# EAGLE design Data_Interlock (EAGLE 7.1.0)
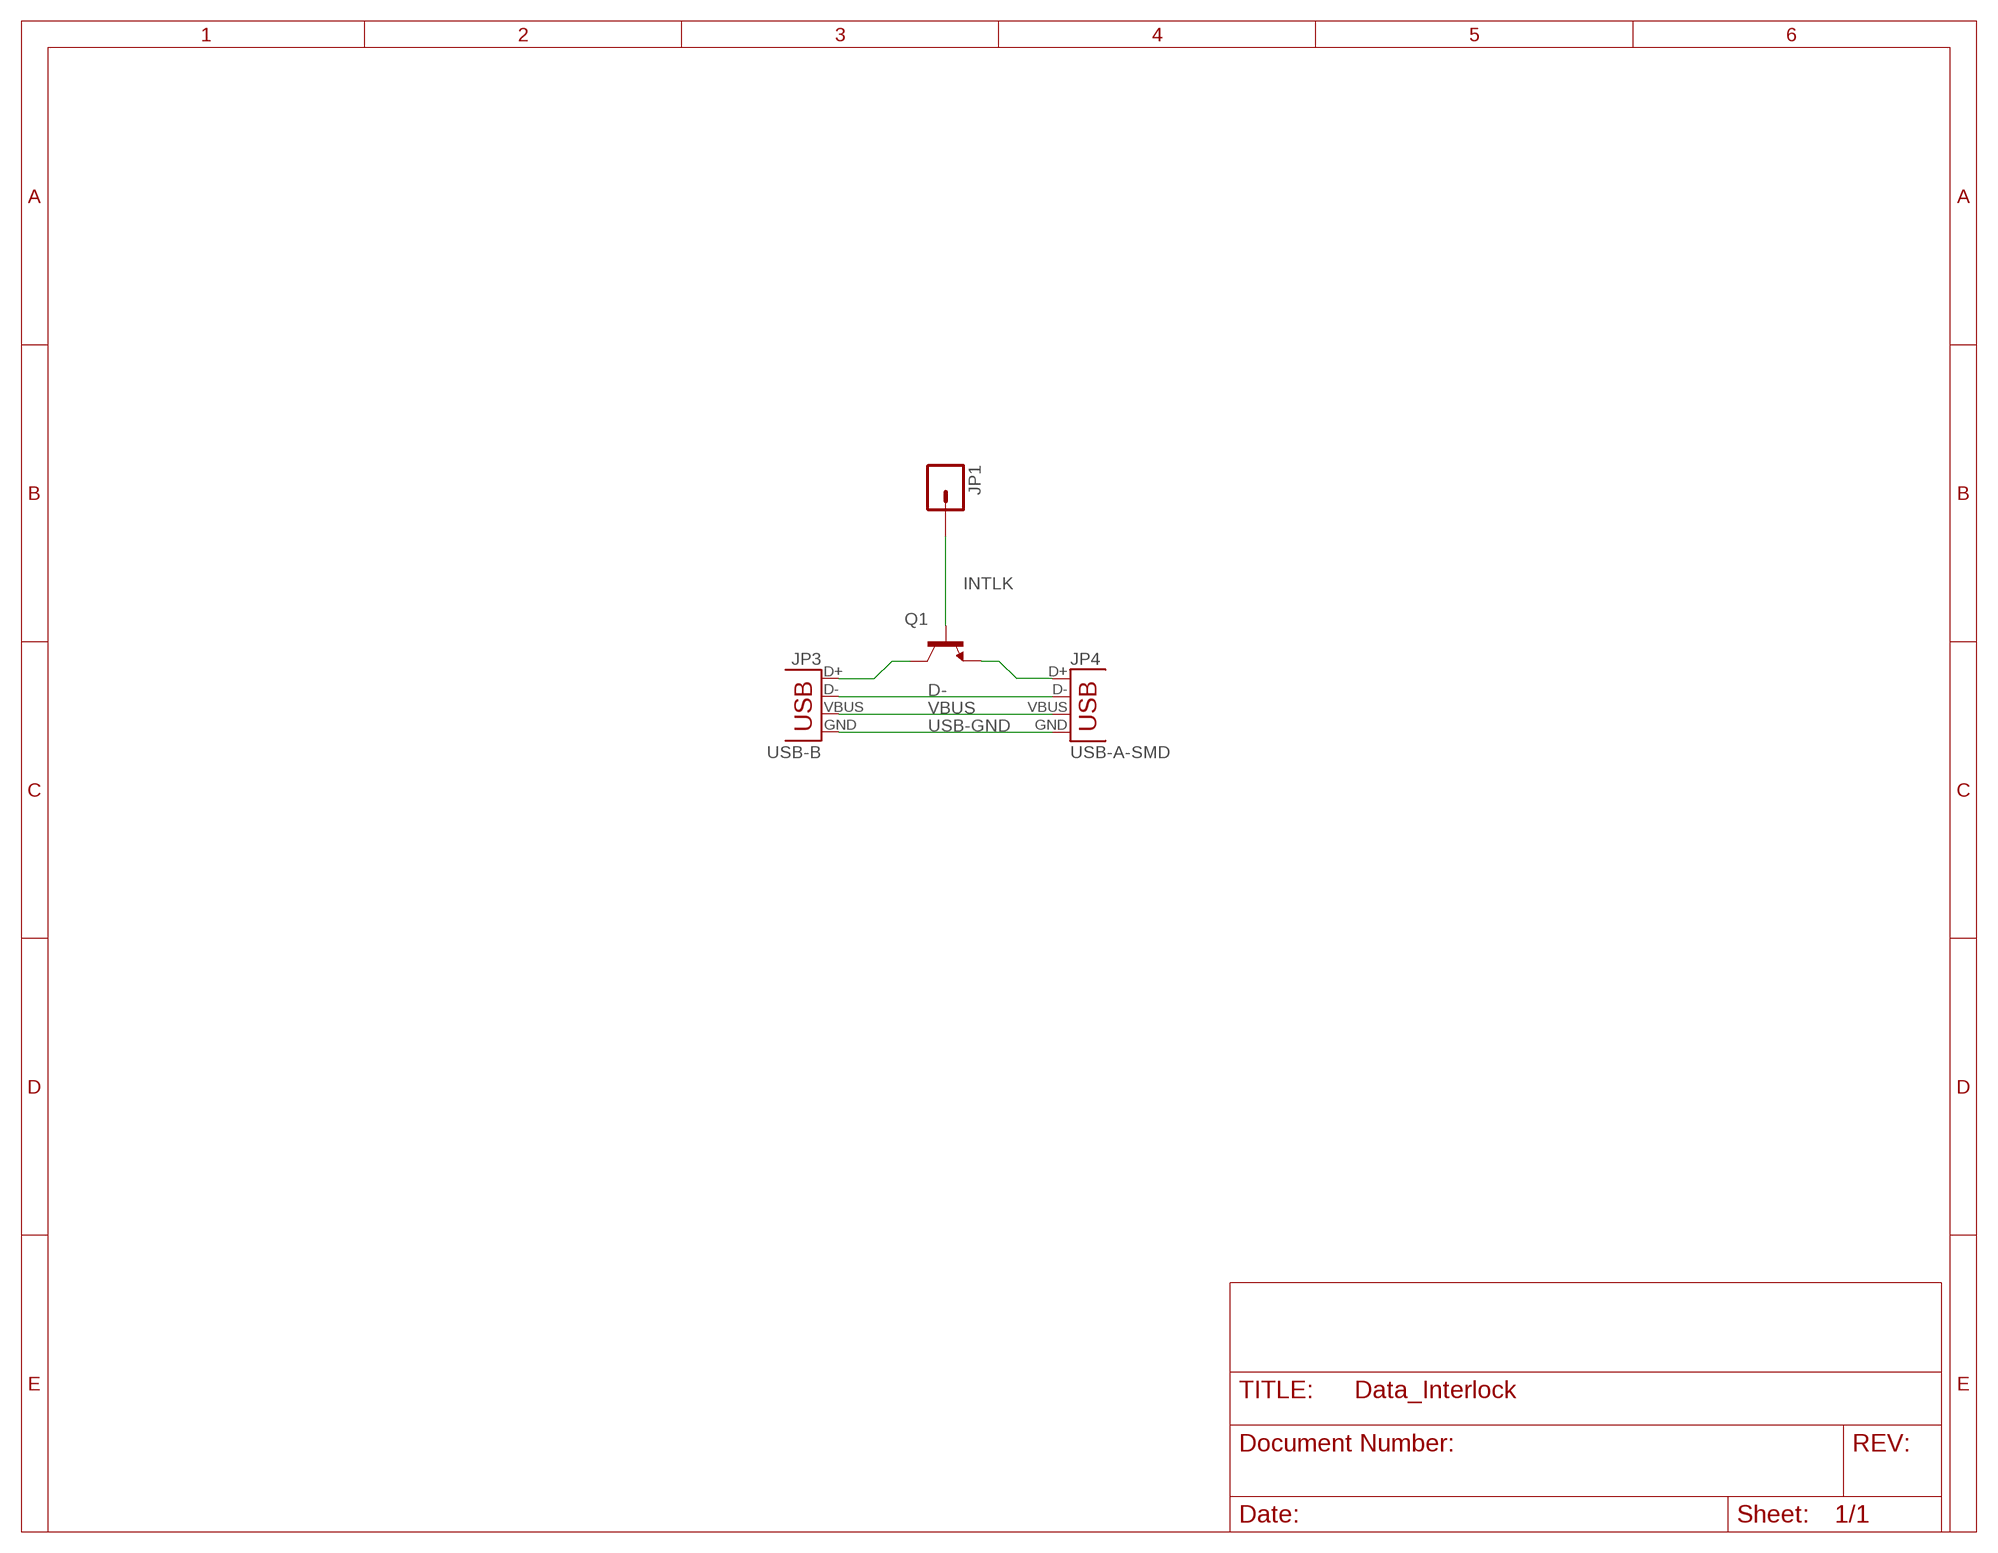
[diagram p0: schematic, sheet 1]

## Parts
JP1  M01PTH_LONGPAD  [1X01_LONGPAD]
JP3  USB-B  USBPTH  [USB-B-PTH]
JP4  USB-A-SMD  [USB-A-S-NOSILK-FEMALE]
Q1  TRANSISTOR_NPNBC547  [TO-92-AMMO]

## Nets
D-: JP3.D- JP4.D-
INTLK: JP1.1 Q1.2(B)
N$4: JP3.D+ Q1.1(C)
N$5: JP4.D+ Q1.3(E)
USB-GND: JP3.GND JP4.GND
VBUS: JP3.VBUS JP4.VBUS

## Library data of the parts
JP1 = SparkFun-Connectors:M01: Header 1 Standard 1-pin 0.1" header. Use with straight break away headers (SKU : PRT-00116), right angle break away headers (PRT-00553), swiss pins (PRT-00743), machine pins (PRT-00117), and female headers (PRT-00115).
JP3 = SparkFun-Connectors:USB: USB Connectors USB-B-PTH is fully proven SKU : PRT-00139/CONN-08278 USB-miniB is fully proven SKU : PRT-00587 USB-A-PCB is untested. USB-A-H is throughly reviewed, but untested. Spark Fun Electronics SKU : PRT-00437 USB-B-SMT is throughly reviewed, but untested. Needs silkscreen touching up. USB-A-S has not been used/tested USB-MB-H has not been used/tested USB-MICROB has been used. CONN-09505; PROD_ID: CONN-08278
JP4 = SparkFun-Connectors:USB: USB Connectors USB-B-PTH is fully proven SKU : PRT-00139/CONN-08278 USB-miniB is fully proven SKU : PRT-00587 USB-A-PCB is untested. USB-A-H is throughly reviewed, but untested. Spark Fun Electronics SKU : PRT-00437 USB-B-SMT is throughly reviewed, but untested. Needs silkscreen touching up. USB-A-S has not been used/tested USB-MB-H has not been used/tested USB-MICROB has been used. CONN-09505; PROD_ID: CONN-09520
Q1 = SparkFun-DiscreteSemi:TRANSISTOR_NPN: Generic NPN BJT MMBT2222A - TRANS-08049 (SOT-23, 1A 40V) MPSA42 - TRANS-09116 (SOT-23, 500mA 300V) MMBT5088LT1G - TRANS-11160 (SOT-23, 50 mA 30V) BC547 - COM-08928 <http://www.sparkfun.com/products/8928> (TO-92 45V 100mA) (1.Collector 2.Base 3.Emitter) 2N3904 - COM-00521 <http://www.sparkfun.com/products/521> (TO-92 40V 200mA) (1.Emitter 2.Base 3.Collector) P2N2222A - COM-12852 <http://www.sparkfun.com/products/12852> (TO-92 40V 600mA) (1.Collector 2.Base 3.Emitter)

## Board
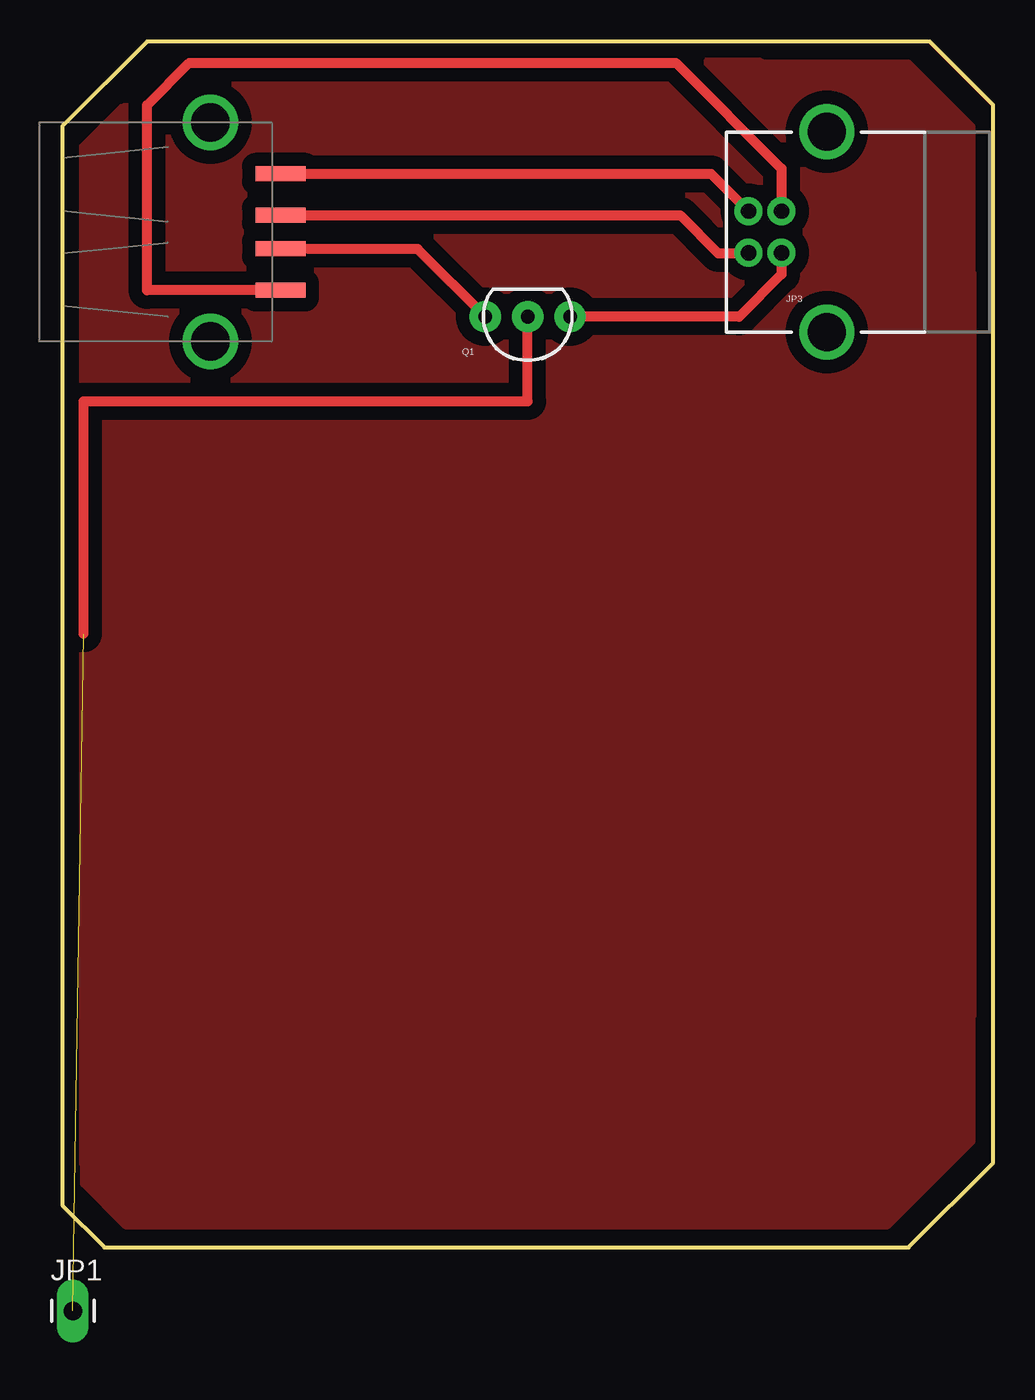
[diagram p1: board, top side]

Size 55.88 x 72.39 mm. Coordinates in mm from the lower left corner, seen from the top.
Outline: 0,2.54 2.54,0 50.8,0 55.88,5.08 55.88,68.58 52.07,72.39 5.08,72.39 0,67.31 0,2.54
Copper layers (1*16): Top 0.035mm / dielectric 1.5mm / Bottom 0.035mm
Design rules "default *": minimum track width 24mil, minimum drill 24mil, track to track 32mil, track to pad 32mil, pad to pad 16mil, via to via 16mil, smd to smd 16mil, copper to edge 24mil, drill to drill 8mil, minimum pad ring 10mil, minimum via ring 8mil, stop-mask expansion 4mil, vias tented up to drill 0mil, thermal gap 18mil

### Footprints (pad centres in the part's own frame; a part is rotated, then mirrored left to right if it is on the bottom)
1X01_LONGPAD = drill 1.118 pad 1.88 long: 1 0,0
USB-B-PTH = drill 0.914 pad 1.676: D+ 0,1.25; D- 1.981,1.25; GND 0,-1.25; VBUS 1.981,-1.25 | drill 2.286: S1 -2.718,-6.02; S2 -2.718,6.02
USB-A-S-NOSILK-FEMALE = smd 3 x 0.9: D+ 4.212,-1; D- 4.212,1; GND 4.212,-3.5; VBUS 4.212,3.5 | drill 2.311: S1 0,-6.566; S2 0,6.566
TO-92-AMMO = drill 0.813 pad 1.88: 1 -2.54,0; 2 0,0; 3 2.54,0

### Placement (x,y rotation side)
JP1  0.64,-3.81 0 top  (outside the outline)
JP3  43.18,60.96 180 top
JP4  8.89,60.96 0 top
Q1  27.94,55.88 180 top

### Tracks (layer width: path | path; a pad name or v marks a point on that pad's centre or on a via)
D-
  Top 0.61: JP4.D- 37.1,61.96 39.37,59.69 41.18,59.69 JP3.D-
GND
  pour Top: 54.61,6.35 49.53,1.27 3.81,1.27 1.27,3.81 1.27,66.04 6.35,71.12 50.8,71.12 54.61,67.31
INTLK  (1 unrouted)
  Top 0.61: 1.27,36.83 1.27,50.8 27.94,50.8 Q1.2
N$2
  pour Top: 1.27,5.08 45.72,5.08 54.61,13.97 54.61,58.42 41.91,71.12 6.35,71.12 1.27,66.04
N$4
  Top 0.61: JP3.D+ 43.18,58.42 40.64,55.88 Q1.1
N$5
  Top 0.61: JP4.D+ 14.78,59.94 21.34,59.94 Q1.3
USB-GND
  Top 0.61: JP4.GND 5.08,57.46 5.08,68.58 7.62,71.12 36.83,71.12 43.18,64.77 JP3.GND
VBUS
  Top 0.61: JP4.VBUS 38.95,64.46 JP3.VBUS